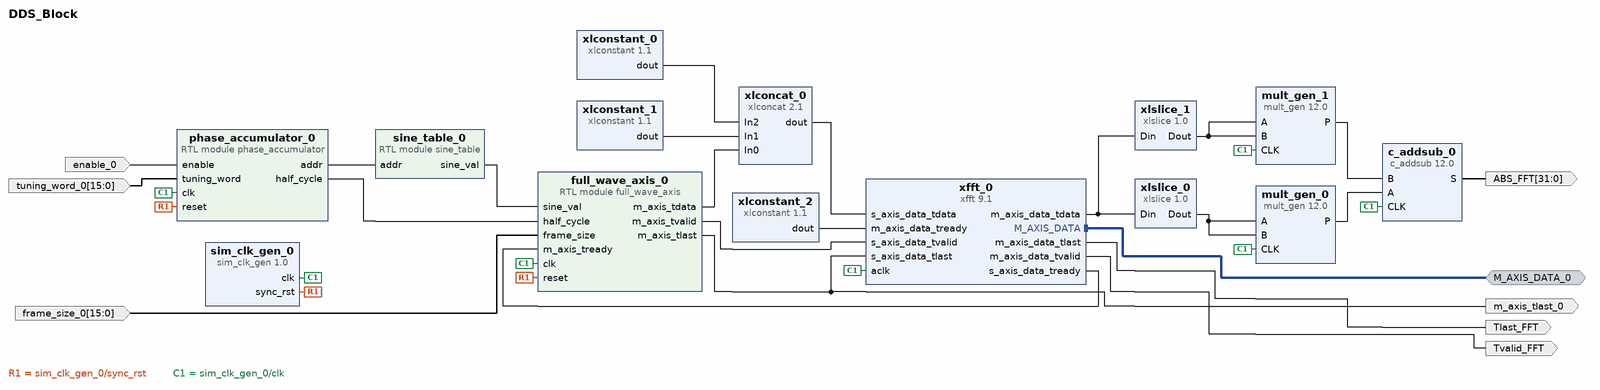
[diagram p0: block diagram of the top level]
# Vivado block design DDS_Block, xc7a35tcpg236-1, Vivado 2025.2
create_bd_design DDS_Block

create_bd_intf_port -mode Master -vlnv xilinx.com:interface:axis_rtl:1.0 M_AXIS_DATA_0
create_bd_port -dir I enable_0
create_bd_port -dir I -from 15 -to 0 tuning_word_0
create_bd_port -dir I -from 15 -to 0 frame_size_0
create_bd_port -dir O -from 31 -to 0 -type data ABS_FFT
create_bd_port -dir O Tlast_FFT
create_bd_port -dir O Tvalid_FFT
create_bd_port -dir O m_axis_tlast_0

create_bd_cell -type module -reference sine_table sine_table_0
create_bd_cell -type module -reference phase_accumulator phase_accumulator_0
create_bd_cell -type ip -vlnv xilinx.com:ip:xfft:9.1 xfft_0
set_property -dict {CONFIG.input_width 16 CONFIG.output_ordering natural_order} [get_bd_cells xfft_0]
create_bd_cell -type ip -vlnv xilinx.com:ip:xlconstant:1.1 xlconstant_0
set_property -dict {CONFIG.CONST_VAL 0 CONFIG.CONST_WIDTH 16} [get_bd_cells xlconstant_0]
create_bd_cell -type ip -vlnv xilinx.com:ip:xlconcat:2.1 xlconcat_0
set_property -dict {CONFIG.IN0_WIDTH 8 CONFIG.IN1_WIDTH 8 CONFIG.IN2_WIDTH 16 CONFIG.NUM_PORTS 3} [get_bd_cells xlconcat_0]
create_bd_cell -type ip -vlnv xilinx.com:ip:sim_clk_gen:1.0 sim_clk_gen_0
set_property -dict {CONFIG.CLOCK_TYPE Single_Ended} [get_bd_cells sim_clk_gen_0]
create_bd_cell -type module -reference full_wave_axis full_wave_axis_0
create_bd_cell -type ip -vlnv xilinx.com:ip:xlslice:1.0 xlslice_0
set_property -dict {CONFIG.DIN_FROM 31 CONFIG.DIN_TO 16 CONFIG.DOUT_WIDTH 16} [get_bd_cells xlslice_0]
create_bd_cell -type ip -vlnv xilinx.com:ip:xlslice:1.0 xlslice_1
set_property -dict {CONFIG.DIN_FROM 15} [get_bd_cells xlslice_1]
create_bd_cell -type ip -vlnv xilinx.com:ip:mult_gen:12.0 mult_gen_0
set_property -dict [list \
  CONFIG.MultType Parallel_Multiplier \
  CONFIG.PortAType Signed \
  CONFIG.PortAWidth 16 \
  CONFIG.PortBType Signed \
  CONFIG.PortBWidth 16 \
] [get_bd_cells mult_gen_0]
create_bd_cell -type ip -vlnv xilinx.com:ip:mult_gen:12.0 mult_gen_1
set_property -dict [list \
  CONFIG.PortAType Signed \
  CONFIG.PortAWidth 16 \
  CONFIG.PortBType Signed \
  CONFIG.PortBWidth 16 \
] [get_bd_cells mult_gen_1]
create_bd_cell -type ip -vlnv xilinx.com:ip:c_addsub:12.0 c_addsub_0
set_property -dict [list \
  CONFIG.A_Width 32 \
  CONFIG.B_Value 00000000000000000000000000000000 \
  CONFIG.B_Width 32 \
  CONFIG.CE false \
  CONFIG.Latency 1 \
  CONFIG.Out_Width 32 \
] [get_bd_cells c_addsub_0]
create_bd_cell -type ip -vlnv xilinx.com:ip:xlconstant:1.1 xlconstant_1
set_property -dict {CONFIG.CONST_VAL 0 CONFIG.CONST_WIDTH 8} [get_bd_cells xlconstant_1]
create_bd_cell -type ip -vlnv xilinx.com:ip:xlconstant:1.1 xlconstant_2
set_property -dict {CONFIG.CONST_VAL 0 CONFIG.CONST_WIDTH 1} [get_bd_cells xlconstant_2]

# ---- connections ----

connect_bd_intf_net [get_bd_intf_ports M_AXIS_DATA_0] [get_bd_intf_pins xfft_0/M_AXIS_DATA]
connect_bd_net [get_bd_pins c_addsub_0/S] [get_bd_ports ABS_FFT]
connect_bd_net -net enable_0_1 [get_bd_ports enable_0] [get_bd_pins phase_accumulator_0/enable]
connect_bd_net -net frame_size_0_1 [get_bd_ports frame_size_0] [get_bd_pins full_wave_axis_0/frame_size]
connect_bd_net [get_bd_pins full_wave_axis_0/m_axis_tdata] [get_bd_pins xlconcat_0/In0]
connect_bd_net [get_bd_pins full_wave_axis_0/m_axis_tlast] [get_bd_ports m_axis_tlast_0] [get_bd_pins xfft_0/s_axis_data_tlast]
connect_bd_net [get_bd_pins full_wave_axis_0/m_axis_tvalid] [get_bd_pins xfft_0/s_axis_data_tvalid]
connect_bd_net [get_bd_pins mult_gen_0/P] [get_bd_pins c_addsub_0/A]
connect_bd_net [get_bd_pins mult_gen_1/P] [get_bd_pins c_addsub_0/B]
connect_bd_net [get_bd_pins phase_accumulator_0/addr] [get_bd_pins sine_table_0/addr]
connect_bd_net [get_bd_pins phase_accumulator_0/half_cycle] [get_bd_pins full_wave_axis_0/half_cycle]
connect_bd_net -net reset_0_1 [get_bd_pins sim_clk_gen_0/sync_rst] [get_bd_pins phase_accumulator_0/reset] [get_bd_pins full_wave_axis_0/reset]
connect_bd_net [get_bd_pins sim_clk_gen_0/clk] \
  [get_bd_pins xfft_0/aclk] [get_bd_pins phase_accumulator_0/clk] [get_bd_pins full_wave_axis_0/clk] \
  [get_bd_pins mult_gen_0/CLK] [get_bd_pins mult_gen_1/CLK] [get_bd_pins c_addsub_0/CLK]
connect_bd_net [get_bd_pins sine_table_0/sine_val] [get_bd_pins full_wave_axis_0/sine_val]
connect_bd_net -net tuning_word_0_1 [get_bd_ports tuning_word_0] [get_bd_pins phase_accumulator_0/tuning_word]
connect_bd_net [get_bd_pins xfft_0/m_axis_data_tdata] [get_bd_pins xlslice_1/Din] [get_bd_pins xlslice_0/Din]
connect_bd_net [get_bd_pins xfft_0/m_axis_data_tlast] [get_bd_ports Tlast_FFT]
connect_bd_net [get_bd_pins xfft_0/m_axis_data_tvalid] [get_bd_ports Tvalid_FFT]
connect_bd_net [get_bd_pins xfft_0/s_axis_data_tready] [get_bd_pins full_wave_axis_0/m_axis_tready]
connect_bd_net [get_bd_pins xlconcat_0/dout] [get_bd_pins xfft_0/s_axis_data_tdata]
connect_bd_net [get_bd_pins xlconstant_0/dout] [get_bd_pins xlconcat_0/In2]
connect_bd_net [get_bd_pins xlconstant_1/dout] [get_bd_pins xlconcat_0/In1]
connect_bd_net [get_bd_pins xlconstant_2/dout] [get_bd_pins xfft_0/m_axis_data_tready]
connect_bd_net [get_bd_pins xlslice_0/Dout] [get_bd_pins mult_gen_0/B] [get_bd_pins mult_gen_0/A]
connect_bd_net [get_bd_pins xlslice_1/Dout] [get_bd_pins mult_gen_1/B] [get_bd_pins mult_gen_1/A]

validate_bd_design
save_bd_design
